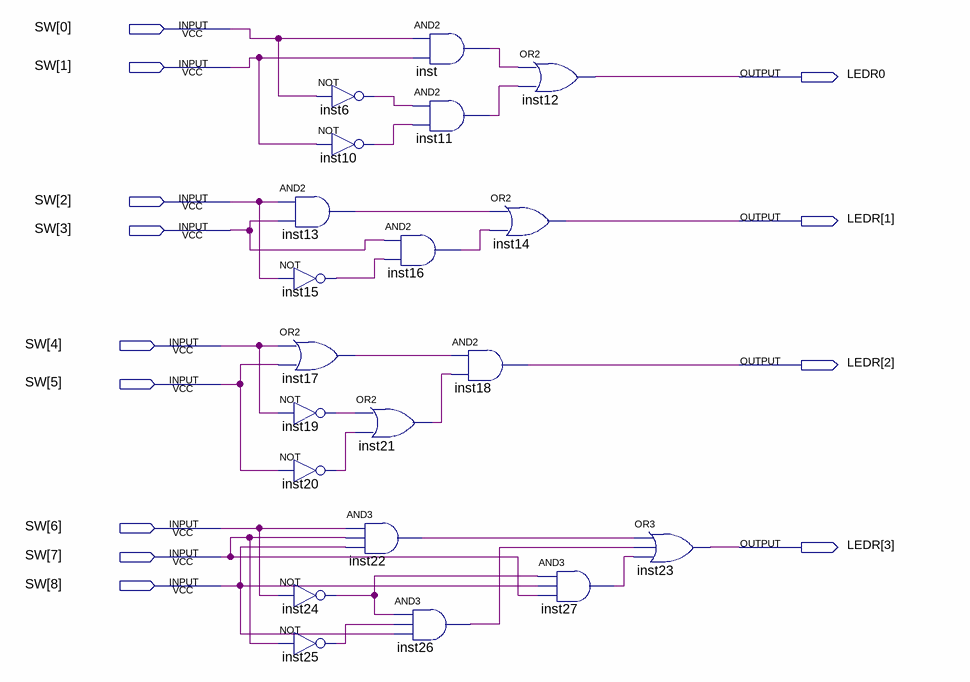
[diagram p0: schematic sheet]
// Quartus schematic MainDiagram.bdf as structural Verilog: 20 symbols, 13 pins
module MainDiagram (
  input  [8:0] SW,
  output LEDR0,
  output [3:1] LEDR
);

  wire inst6_out, inst10_out, inst11_out, inst13_out, inst15_out, inst16_out, inst17_out, inst19_out,
       inst20_out, inst21_out, inst22_out, inst24_out, inst25_out, inst26_out, inst27_out, inst_out;

  and inst13 (inst13_out, SW[2], SW[3]);
  not inst15 (inst15_out, SW[2]);
  or inst17 (inst17_out, SW[4], SW[5]);
  not inst19 (inst19_out, SW[4]);
  not inst20 (inst20_out, SW[5]);
  not inst24 (inst24_out, SW[6]);
  not inst25 (inst25_out, SW[7]);
  not inst6 (inst6_out, SW[0]);
  not inst10 (inst10_out, SW[1]);
  or inst21 (inst21_out, inst19_out, inst20_out);
  and inst22 (inst22_out, SW[6], SW[7], SW[8]);
  and inst (inst_out, SW[0], SW[1]);
  and inst11 (inst11_out, inst6_out, inst10_out);
  and inst16 (inst16_out, SW[3], inst15_out);
  and inst26 (inst26_out, inst24_out, inst25_out, SW[8]);
  or inst14 (LEDR[1], inst13_out, inst16_out);
  and inst18 (LEDR[2], inst17_out, inst21_out);
  or inst12 (LEDR0, inst_out, inst11_out);
  and inst27 (inst27_out, inst24_out, SW[8], SW[7]);
  or inst23 (LEDR[3], inst22_out, inst26_out, inst27_out);
endmodule
